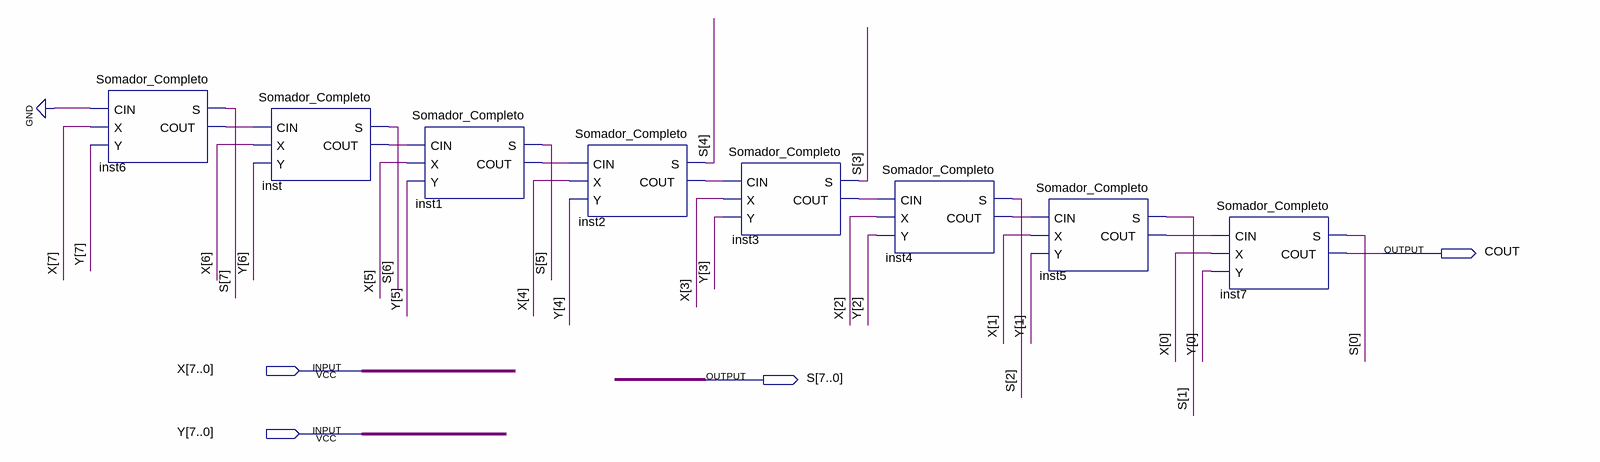
[diagram p0: schematic sheet]
// Quartus schematic Somador_Final.bdf as structural Verilog: 8 symbols, 4 pins
module Somador_Final (
  input  [7:0] X,
  input  [7:0] Y,
  output COUT,
  output [7:0] S
);

  wire inst1_cout, inst2_cout, inst3_cout, inst4_cout, inst5_cout, inst6_cout, inst_cout;

  Somador_Completo inst6 (.CIN(1'b0), .X(X[7]), .Y(Y[7]), .S(S[7]), .COUT(inst6_cout));
  Somador_Completo inst (.CIN(inst6_cout), .X(X[6]), .Y(Y[6]), .S(S[6]), .COUT(inst_cout));
  Somador_Completo inst1 (.CIN(inst_cout), .X(X[5]), .Y(Y[5]), .S(S[5]), .COUT(inst1_cout));
  Somador_Completo inst2 (.CIN(inst1_cout), .X(X[4]), .Y(Y[4]), .S(S[4]), .COUT(inst2_cout));
  Somador_Completo inst3 (.CIN(inst2_cout), .X(X[3]), .Y(Y[3]), .S(S[3]), .COUT(inst3_cout));
  Somador_Completo inst4 (.CIN(inst3_cout), .X(X[2]), .Y(Y[2]), .S(S[2]), .COUT(inst4_cout));
  Somador_Completo inst5 (.CIN(inst4_cout), .X(X[1]), .Y(Y[1]), .S(S[1]), .COUT(inst5_cout));
  Somador_Completo inst7 (.CIN(inst5_cout), .X(X[0]), .Y(Y[0]), .S(S[0]), .COUT(COUT));
endmodule
